# Altium schematic sheet PERIPHERALS.SchDoc
size A3; SheetNumber: 2; SheetTotal: 4
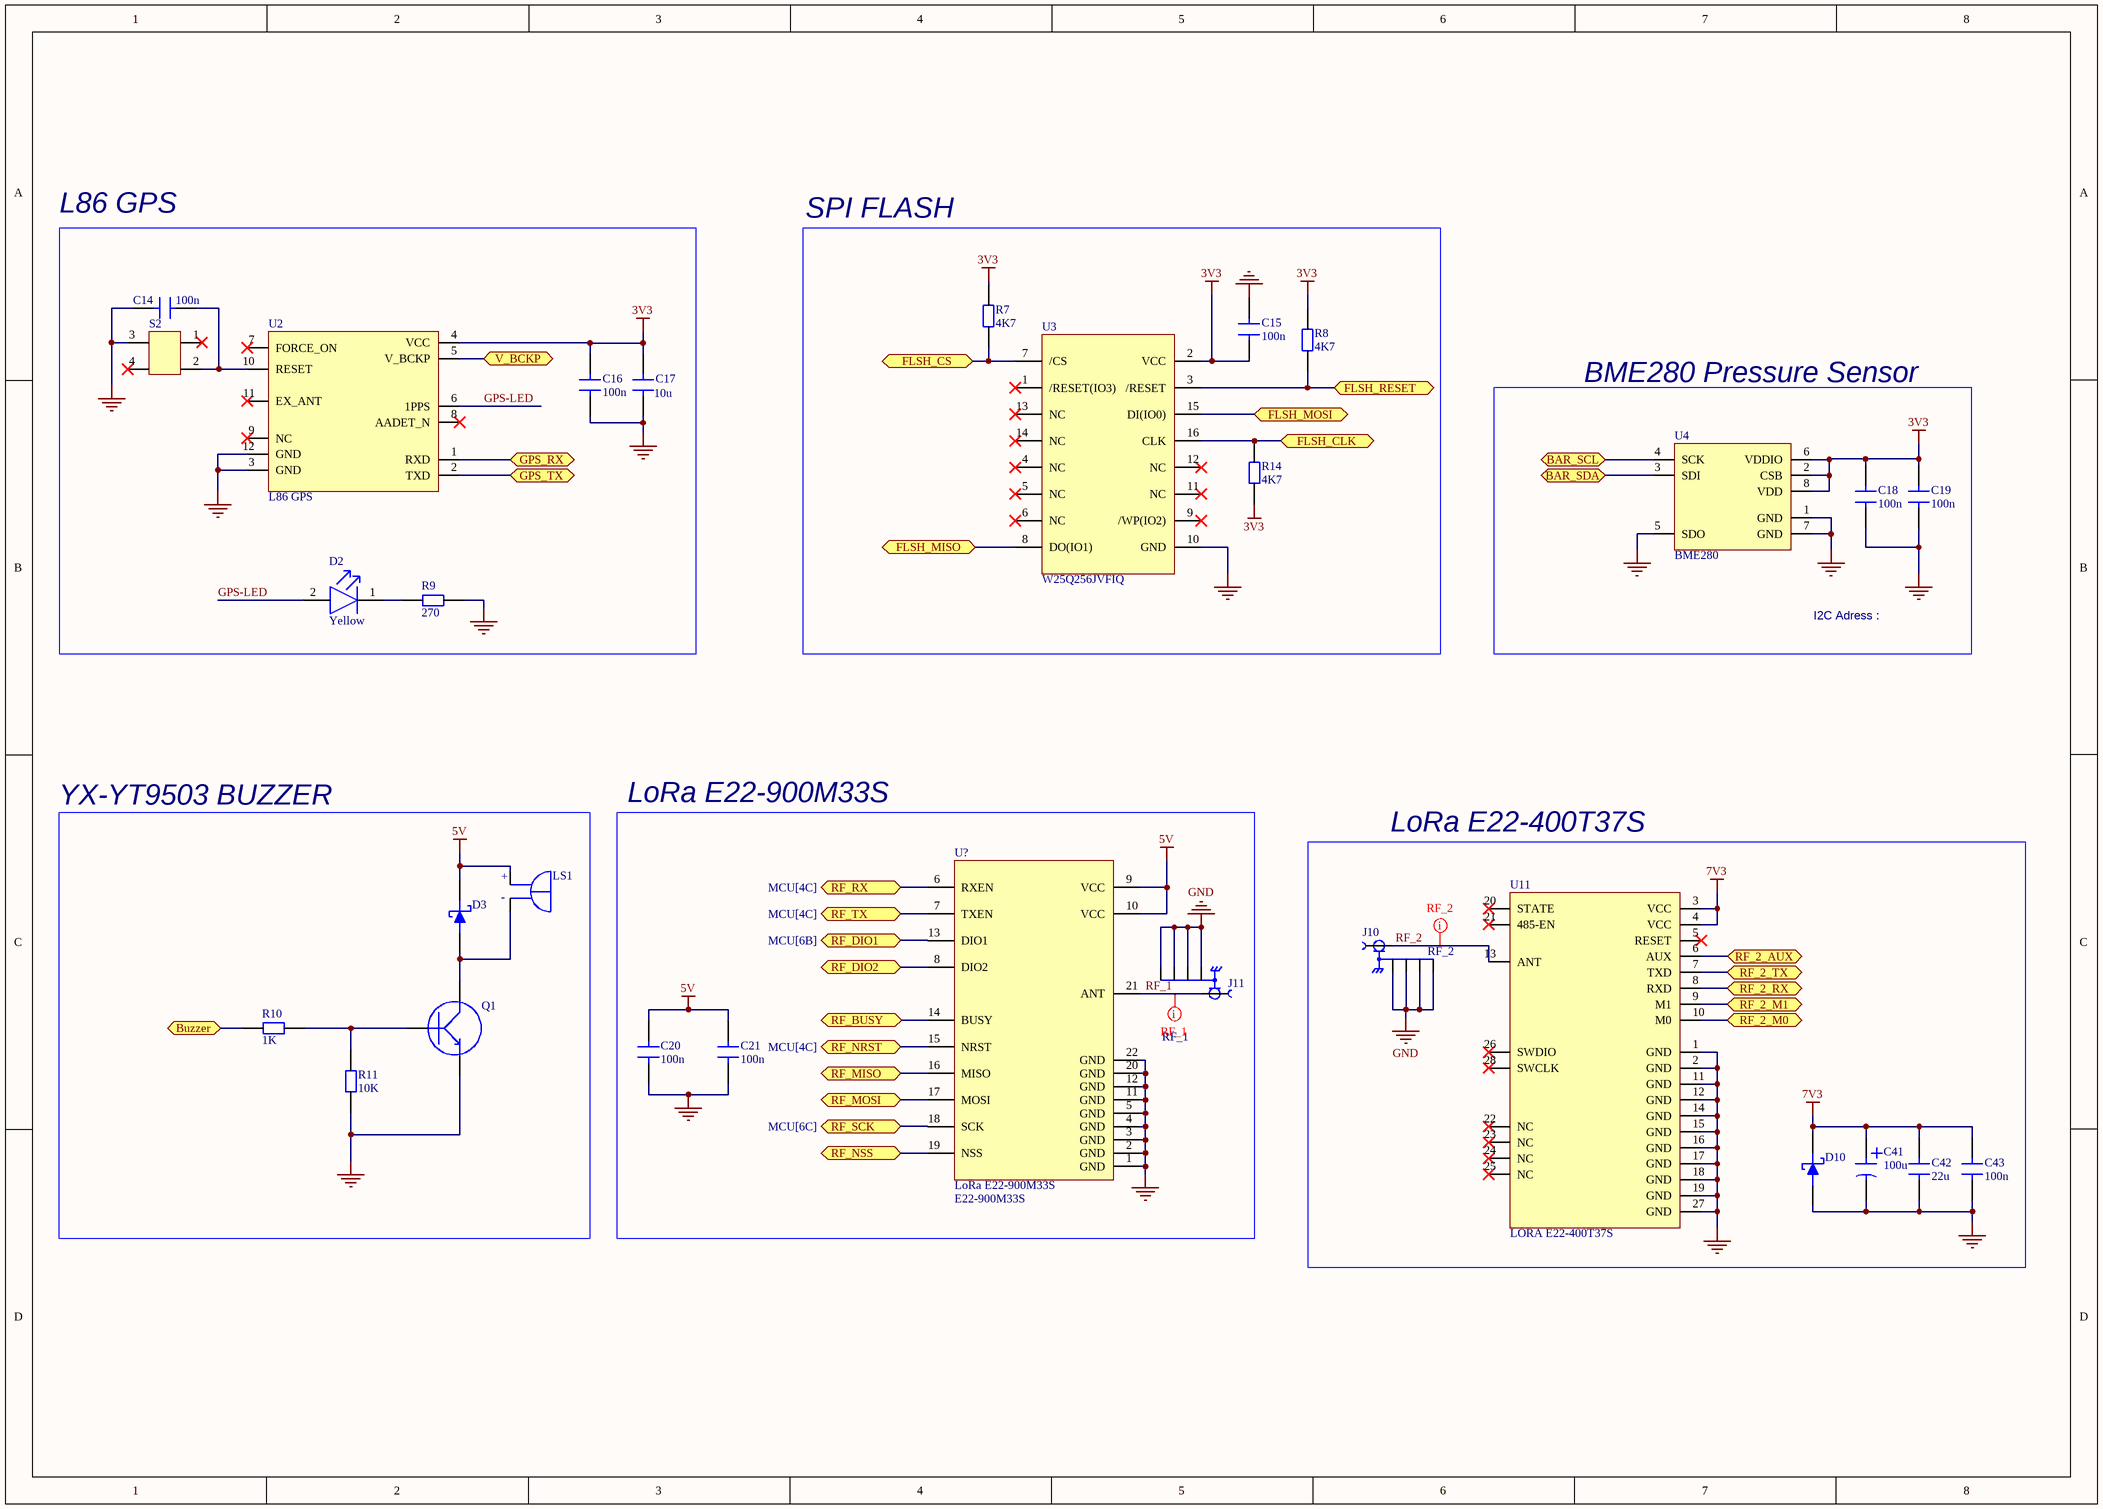
[diagram p0: PERIPHERALS.SchDoc]

## Parts
C14  100n  [CAP 0603]
C15  100n  [CAP 0603]
C16  100n  [CAP 0805]
C17  10u  [CAP 0805]
C18  100n  [CAP 0603]
C19  100n  [CAP 0603]
C20  100n  [CAP 0805]
C21  100n  [CAP 0805]
C41  100u  [865060653010]
C42  22u  [CAP 1210]
C43  100n  [CAP 0805]
D2  Yellow  [FP-LTST-C170YKT-MFG]
D3  TMBAT49FILM  [TMBAT49FILM]  (value not drawn)
D10  SMBJ14CA  [SMBJ12CA-13-F]  (value not drawn)
J10  RFPC-SMA27-F  [GRADCONN_RFPC-SMA27-F]  (value not drawn)
J11  RFPC-SMA27-F  [GRADCONN_RFPC-SMA27-F]  (value not drawn)
LS1  KXG0912C  [XDCR_KXG0912C]  (value not drawn)
Q1  BC817-25W,115  [BC817-25]  (value not drawn)
R7  4K7  [RES 0805]
R8  4K7  [RES 0805]
R9  270  [RES 0805]
R10  1K  [RES 0805]
R11  10K  [RES 0805]
R14  4K7  [RES 0805]
S2  FSM4JSMATR  [FSM4JSMATR]  (value not drawn)
U2  L86 GPS  [L86]
U3  W25Q256JVFIQ  [W25Q256JVFIQ]
U4  BME280  [BME280]
U11  LORA E22-400T37S  [LORA E22-400T37S]
U?  LoRa E22-900M33S  LoRa: E22-900M33S  [LoRa E22-900M33S]

## Blocks framed on the sheet
L86 GPS: C14 C16 C17 D2 R9 S2 U2
SPI FLASH: C15 R7 R8 R14 U3
BME280 Pressure Sensor: C18 C19 U4
YX-YT9503 BUZZER: D3 LS1 Q1 R10 R11
LoRa E22-900M33S: C20 C21 J11 U?
LoRa E22-400T37S: C41-C43 D10 J10 U11

## Ports
BAR_SCL (bidir, see CONNECTORS[7C], MCU[6C]), BAR_SDA (bidir, see CONNECTORS[7C], MCU[6C]), Buzzer (bidir, see MCU[6C]), FLSH_CLK (bidir, see MCU[6B]), FLSH_CS (bidir, see MCU[6B]), FLSH_MISO (bidir, see MCU[6B]), FLSH_MOSI (bidir, see MCU[6B]), FLSH_RESET (bidir, see MCU[4C]), GPS_RX (bidir, see MCU[6B]), GPS_TX (bidir, see MCU[6B]), RF_2_AUX (bidir, see MCU[6B]), RF_2_M0 (bidir, see MCU[6C]), RF_2_M1 (bidir, see MCU[6C]), RF_2_RX (bidir, see MCU[6B]), RF_2_TX (bidir, see MCU[6B]), RF_BUSY (bidir, see MCU[6B]), RF_DIO1 (bidir, see MCU[6B]), RF_DIO2 (bidir, see MCU[4C]), RF_MISO (bidir, see MCU[6C]), RF_MOSI (bidir, see MCU[6C]), RF_NRST (bidir, see MCU[4C]), RF_NSS (bidir, see MCU[6C]), RF_RX (bidir, see MCU[4C]), RF_SCK (bidir, see MCU[6C]), RF_TX (bidir, see MCU[4C]), V_BCKP (bidir, see MCU[5B], POWER[4D])

## Nets
3V3: C15.1 C16.2 C17.2 C18.2 C19.2 R7.2 R8.2 R14.1 U2.4(VCC) U3.2(VCC) U4.2(CSB) U4.6(VDDIO) U4.8(VDD)
5V: C20.2 C21.2 D3.1 LS1.P(POS) U?.9(VCC) U?.10(VCC)
7V3: C41.1(P) C42.2 C43.2 D10.2 U11.3(VCC) U11.4(VCC)
GND: C14.1 C15.2 C16.1 C17.1 C18.1 C19.1 C20.1 C21.1 C41.2(N) C42.1 C43.1 D10.1 J10.G1 J10.G2 J10.G3 J10.G4 J11.G1 J11.G2 J11.G3 J11.G4 Q1.2(E) R9.2 R11.1 S2.3 U2.3(GND) U2.12(GND) U3.10(GND) U4.1(GND) U4.5(SDO) U4.7(GND) U11.1(GND) U11.2(GND) U11.11(GND) U11.12(GND) U11.14(GND) U11.15(GND) U11.16(GND) U11.17(GND) U11.18(GND) U11.19(GND) U11.27(GND) U?.1(GND) U?.2(GND) U?.3(GND) U?.4(GND) U?.5(GND) U?.11(GND) U?.12(GND) U?.20(GND) U?.22(GND)
BAR_SCL: U4.4(SCK) ; port BAR_SCL
BAR_SDA: U4.3(SDI) ; port BAR_SDA
Buzzer: R10.1 ; port Buzzer
FLSH_CLK: R14.2 U3.16(CLK) ; port FLSH_CLK
FLSH_CS: R7.1 U3.7(/CS) ; port FLSH_CS
FLSH_MISO: U3.8(DO(IO1)) ; port FLSH_MISO
FLSH_MOSI: U3.15(DI(IO0)) ; port FLSH_MOSI
FLSH_RESET: R8.1 U3.3(/RESET) ; port FLSH_RESET
GPS-LED: D2.2(A) U2.6(1PPS)
GPS_RX: U2.1(RXD) ; port GPS_RX
GPS_TX: U2.2(TXD) ; port GPS_TX
RF_1: J11.1 U?.21(ANT)
RF_2: J10.1 U11.13(ANT)
RF_2_AUX: U11.6(AUX) ; port RF_2_AUX
RF_2_M0: U11.10(M0) ; port RF_2_M0
RF_2_M1: U11.9(M1) ; port RF_2_M1
RF_2_RX: U11.8(RXD) ; port RF_2_RX
RF_2_TX: U11.7(TXD) ; port RF_2_TX
RF_BUSY: U?.14(BUSY) ; port RF_BUSY
RF_DIO1: U?.13(DIO1) ; port RF_DIO1
RF_DIO2: U?.8(DIO2) ; port RF_DIO2
RF_MISO: U?.16(MISO) ; port RF_MISO
RF_MOSI: U?.17(MOSI) ; port RF_MOSI
RF_NRST: U?.15(NRST) ; port RF_NRST
RF_NSS: U?.19(NSS) ; port RF_NSS
RF_RX: U?.6(RXEN) ; port RF_RX
RF_SCK: U?.18(SCK) ; port RF_SCK
RF_TX: U?.7(TXEN) ; port RF_TX
V_BCKP: U2.5(V_BCKP) ; port V_BCKP
NetC14_2: C14.2 S2.2 U2.10(RESET)
NetD2_1: D2.1(C) R9.1
NetD3_2: D3.2 LS1.N(NEG) Q1.3(C)
NetQ1_1: Q1.1(B) R10.2 R11.2

Not connected (* = marked no-connect by the designer): S2 1* 4*; U2 7(FORCE_ON)* 8(AADET_N)* 9(NC)* 11(EX_ANT)*; U3 1(/RESET(IO3))* 4(NC)* 5(NC)* 6(NC)* 9(/WP(IO2))* 11(NC)* 12(NC)* 13(NC)* 14(NC)*; U11 5(RESET)* 20(STATE)* 21(485-EN)* 22(NC)* 23(NC)* 24(NC)* 25(NC)* 26(SWDIO)* 28(SWCLK)*

## Layout directives
net class RF_1: RF_1
net class RF_2: RF_2

## Notes on the sheet
- I2C Adress :
- (in symbol KXG0912C) +; -

## Library data of the parts
C14 C15 C18 C19 = CAP 0603 50V: Capacitor SMD 0603 50V
C16 C20 C21 C43 = CAP 0805 50V: Capacitor SMD 0805 50V
C17 = CAP 0805 25V: Capacitor SMD 0805 25V
C41 = 865060653010: Aluminum Electrolytic Capacitor, Polarized, Aluminum (wet), 50V, 20% +Tol, 20% -Tol, 100uF, Surface Mount, 3333; Manufacturer: Wurth Electronics; Supplier 1: Farnell; Manufacturer Part Number: 865060653010; RoHS: Yes; Category: Aluminum Electrolytic Capacitors; Stock 1: 176; Pricing 1: 1=0,825, 10=0,63, 50=0,551, 100=0,481, 200=0,427, 500=0,355, 2500=0,348, 5000=0,341 (EUR); ComponentLink1URL: http://www.farnell.com/datasheets/1880078.pdf?src-supplier=Farnell; ComponentLink1Description: http://www.farnell.com/datasheets/1880078.pdf?src-supplier=Farnell; ComponentLink2URL: http://www.farnell.com/datasheets/1880078.pdf?src-supplier=Newark; ComponentLink2Description: http://www.farnell.com/datasheets/1880078.pdf?src-supplier=Newark; ComponentLink3URL: http://www.farnell.com/datasheets/1880078.pdf?src-supplier=Element14; ComponentLink3Description: http://www.farnell.com/datasheets/1880078.pdf?src-supplier=Element14; ComponentLink4URL: https://katalog.we-online.de/pbs/datasheet/865060653010.pdf?src-supplier=Digikey; ComponentLink4Description: https://katalog.we-online.de/pbs/datasheet/865060653010.pdf?src-supplier=Digikey
C42 = CAP 1210 25V: Capacitor SMD 1210 25V
D2 = CMP-1674-00003-7: LED YELLOW CLEAR SMD; Viewing Angle: 130°; Luminous Intensity: 6mcd; Test Current: 10mA; Number of Elements: 1; Forward Current: 20mA; Forward Voltage: 2.1V; Reverse Voltage: 5V; Power Dissipation: 60mW; Lens Style: Diffused; Wavelength: 585nm; Lens Color: Colorless; Dominant Wavelength: 588nm; RoHS Compliant: Yes; Height: 1.1mm; Min Operating Temperature: -55°C; Max Operating Temperature: 85°C; Number of LEDs: 1; Mount: Surface Mount; Radiation Hardening: No; Illumination Color: Yellow; Length: 3.2mm; Series: CHIPLED 0805; Package Quantity: 1; Packaging: Tape and Reel; Color: Yellow; Depth: 1.6mm; Case/Package: 0805; Lens Transparency: Clear; Case Code (Imperial): 0805; Width: 1.25mm; Case Code (Metric): 2012; Lead Free: Lead Free; Power Rating: 60mW; Number of Pins: 2
D3 = TMBAT49FILM: Rectifier Diode Small Signal Schottky Si 80V 0.5A 2-Pin MELF T/R; Manufacturer: STMicroelectronics; Supplier 1: Mouser; Manufacturer Part Number: TMBAT49FILM; RoHS: Yes; Category: Rectifier Diodes; Stock 1: 11456; Pricing 1: 1=0,55, 10=0,468, 50=0,468, 100=0,326, 1000=0,228, 10000=0,159 (USD); ComponentLink1URL: https://datasheet.ciiva.com/4715/cd00000809-92451-4715102.pdf?src-supplier=Mouser; ComponentLink1Description: https://datasheet.ciiva.com/4715/cd00000809-92451-4715102.pdf?src-supplier=Mouser; ComponentLink2URL: https://datasheet.ciiva.com/16988/0900766b80db299a-16988744.pdf?src-supplier=Allied+Electronics; ComponentLink2Description: https://datasheet.ciiva.com/16988/0900766b80db299a-16988744.pdf?src-supplier=Allied+Electronics; ComponentLink3URL: https://datasheet.ciiva.com/22697/1766334-22697011.pdf?src-supplier=Element14; ComponentLink3Description: https://datasheet.ciiva.com/22697/1766334-22697011.pdf?src-supplier=Element14; ComponentLink4URL: https://datasheet.ciiva.com/16501/cd00000809-16501349.pdf?src-supplier=Future+Electronics; ComponentLink4Description: https://datasheet.ciiva.com/16501/cd00000809-16501349.pdf?src-supplier=Future+Electronics; ComponentLink5URL: https://datasheet.ciiva.com/15144/getdatasheetpartid-39750-15144086.pdf?src-supplier=Verical; ComponentLink5Description: https://datasheet.ciiva.com/15144/getdatasheetpartid-39750-15144086.pdf?src-supplier=Verical; ComponentLink6URL: https://datasheet.ciiva.com/915/cd00000809-915819.pdf?src-supplier=Digikey; ComponentLink6Description: https://datasheet.ciiva.com/915/cd00000809-915819.pdf?src-supplier=Digikey; ComponentLink7URL: https://datasheet.ciiva.com/915/cd00000809-915820.pdf?src-supplier=Digikey; ComponentLink7Description: https://datasheet.ciiva.com/915/cd00000809-915820.pdf?src-supplier=Digikey; ComponentLink8URL: https://datasheet.ciiva.com/915/cd00000809-915821.pdf?src-supplier=Digikey; ComponentLink8Description: https://datasheet.ciiva.com/915/cd00000809-915821.pdf?src-supplier=Digikey; ComponentLink9URL: https://datasheet.ciiva.com/7622/1766334-7622348.pdf?src-supplier=Element14; ComponentLink9Description: https://datasheet.ciiva.com/7622/1766334-7622348.pdf?src-supplier=Element14; ComponentLink10URL: https://datasheet.ciiva.com/7964/cd00000809-7964118.pdf?src-supplier=Element14; ComponentLink10Description: https://datasheet.ciiva.com/7964/cd00000809-7964118.pdf?src-supplier=Element14
D10 = SMBJ14CA: TVS DIODE 14VWM 23.2VC DO214AA; Manufacturer: Littelfuse; Operating Supply Voltage: 14V; Max Surge Current: 25.9A; Number of Channels: 1; Polarity: Bidirectional; Breakdown Voltage: 15.6V; Clamping Voltage: 23.2V; Peak Pulse Power: 600W; Power Line Protection: No; Test Current: 1mA; Leakage Current: 1uA; Diode Type: ZENER; Max Breakdown Voltage: 17.2V; Supplier 1: Future Electronics; Manufacturer Part Number: SMBJ14CA; RoHS: Yes; Category: TVS Diodes; Stock 1: 1300; Pricing 1: 1=0,36, 15=0,29, 75=0,245, 300=0,205, 1500=0,163 (USD); Mount: Surface Mount; Case/Package: DO-214AA; Number of Pins: 2; Weight: 0.00328oz; Min Operating Temperature: -65°C; Max Operating Temperature: 150°C; Packaging: Tape and Reel; Package Quantity: 3000; Reverse Breakdown Voltage: 15.6V; Number of Bidirectional Channels: 1; Reverse Standoff Voltage: 14V; Min Breakdown Voltage: 15.6V; Number of Elements: 1; Peak Pulse Current: 25.9A; Voltage Rating (DC): 14V; Series: SMBJ; Direction: Bidirectional; Termination: SMD/SMT; Max Power Dissipation: 600W; Power Dissipation: 600W; Current: 1mA; Voltage: 14V; Clamping Voltage-Max: 23.2V; Length: 5.59mm; Width: 3.94mm; Height: 2.44mm; RoHS Compliant: Yes; Lead Free: Lead Free; Reach SVHC Compliant: No; ComponentLink1URL: https://datasheet.ciiva.com/331/littelfuse-tvs-diode-smbj-datasheet-pdf-331530.pdf?src-supplier=Digikey; ComponentLink1Description: https://datasheet.ciiva.com/331/littelfuse-tvs-diode-smbj-datasheet-pdf-331530.pdf?src-supplier=Digikey; ComponentLink2URL: https://datasheet.ciiva.com/331/littelfuse-tvs-diode-smbj-datasheet-pdf-331531.pdf?src-supplier=Digikey; ComponentLink2Description: https://datasheet.ciiva.com/331/littelfuse-tvs-diode-smbj-datasheet-pdf-331531.pdf?src-supplier=Digikey; ComponentLink3URL: https://datasheet.ciiva.com/331/littelfuse-tvs-diode-smbj-datasheet-pdf-331529.pdf?src-supplier=Digikey; ComponentLink3Description: https://datasheet.ciiva.com/331/littelfuse-tvs-diode-smbj-datasheet-pdf-331529.pdf?src-supplier=Digikey
J10 J11 = RFPC-SMA27-F: MF: {'manufacturer': u'GradConn'}; Package: None; Price: None; Value: *; MP: RFPC-SMA27-F; Availability: Unavailable
LS1 = KXG0912C: Magnetic Indicator(Active Buzzer), 85Hz, 2.73 dB (SPL), 9.6 diameter(Ø)/L, Width, 5 Height, Pine Type; MP: KXG0912C; Package: None; Price: None; Availability: Unavailable; Value: *
Q1 = BC817-25W,115: BC817 Series 45 V 500 mA NPN General Purpose Transistor - SOT-23; Manufacturer: Nexperia; Supplier 1: Future Electronics; Manufacturer Part Number: BC817-25W,115; RoHS: Yes; Category: BJTs; Stock 1: 99000; Pricing 1: 3000=0,0169, 12000=0,0162, 45000=0,0155, 90000=0,0152, 225000=0,0144 (USD); ComponentLink1URL: https://datasheet.octopart.com/BC817-25W%2C115-NXP-datasheet-29749.pdf?src-supplier=Future+Electronics; ComponentLink1Description: https://datasheet.octopart.com/BC817-25W%2C115-NXP-datasheet-29749.pdf?src-supplier=Future+Electronics; ComponentLink2URL: http://www.farnell.com/datasheets/699988.pdf?src-supplier=Newark; ComponentLink2Description: http://www.farnell.com/datasheets/699988.pdf?src-supplier=Newark; ComponentLink3URL: https://datasheet.octopart.com/BC817-25W%2C115-Nexperia-datasheet-155782301.pdf?src-supplier=TME; ComponentLink3Description: https://datasheet.octopart.com/BC817-25W%2C115-Nexperia-datasheet-155782301.pdf?src-supplier=TME; Supplier Part Number 1: 5067352
R7-R11 R14 = RES 0805: Resistor SMD 0805
S2 = FSM4JSMATR: Switch Tactile OFF (ON) SPST Round Button Gull Wing 0.05A 24VDC 1.57N SMD T/R; Manufacturer: TE Connectivity Alcoswitch; Supplier 1: Digi-Key; Manufacturer Part Number: FSM4JSMATR; RoHS: Yes; Category: Pushbutton Switches; Stock 1: 84996; Pricing 1: 1=0,36, 10=0,351, 25=0,33, 100=0,2866, 250=0,26, 500=0,24188 (USD); ComponentLink1URL: https://datasheet.ciiva.com/16320/eng-cs-1308111-1-switches-core-program-catalog-0308-16320065.pdf?src-supplier=Future+Electronics; ComponentLink1Description: https://datasheet.ciiva.com/16320/eng-cs-1308111-1-switches-core-program-catalog-0308-16320065.pdf?src-supplier=Future+Electronics; ComponentLink2URL: https://datasheet.ciiva.com/1530/1683375-1530944.pdf?src-supplier=Element14; ComponentLink2Description: https://datasheet.ciiva.com/1530/1683375-1530944.pdf?src-supplier=Element14; ComponentLink3URL: https://datasheet.ciiva.com/23765/1486934-23765878.pdf?src-supplier=Newark; ComponentLink3Description: https://datasheet.ciiva.com/23765/1486934-23765878.pdf?src-supplier=Newark; ComponentLink4URL: https://datasheet.ciiva.com/7638/921681-7638037.pdf?src-supplier=Element14; ComponentLink4Description: https://datasheet.ciiva.com/7638/921681-7638037.pdf?src-supplier=Element14
U3 = W25Q256JVFIQ: IC FLASH 256MBIT SPI/QUAD 16SOIC .....                                      The W25Q256JV (256M-bit) Serial Flash memory provides a storage solution for systems with limited / space, pins and power. The 25Q series offers flexibility and performance well beyond ordinary Serial Flash / devices. They are ideal for code shadowing to RAM, executing code directly from Dual/Quad SPI (XIP) / and storing voice, text and data. The device operates on a single 2.7V to 3.6V power supply with current / consumption as low as 1µA for power-down
U4 = BME280: SENSOR PRESSURE HUMIDITY TEMP; Manufacturer: Bosch; Sensor Type: Temperature; Output Type: SPI,I2C; Accuracy: 3%; Response Time: 1s; Supplier 1: Future Electronics; Manufacturer Part Number: BME280; RoHS: No; Category: Temperature and Humidity Sensors; Stock 1: 5185; Pricing 1: 1=6,1, 20=5,53, 150=5,14, 1000=4,78, 5000=4,48 (USD); Mount: Surface Mount; Case/Package: LGA; Number of Pins: 8; Min Operating Temperature: -40°C; Max Operating Temperature: 85°C; Packaging: Cut Tape; Lead Free: Lead Free; ComponentLink1URL: https://ae-bst.resource.bosch.com/media/_tech/media/datasheets/BST-BME280-DS002.pdf?src-supplier=Digi-Key; ComponentLink1Description: https://ae-bst.resource.bosch.com/media/_tech/media/datasheets/BST-BME280-DS002.pdf?src-supplier=Digi-Key; ComponentLink2URL: https://ae-bst.resource.bosch.com/media/_tech/media/product_flyer/BME280_Productflyer_BST_20170109.pdf?src-supplier=Mouser; ComponentLink2Description: https://ae-bst.resource.bosch.com/media/_tech/media/product_flyer/BME280_Productflyer_BST_20170109.pdf?src-supplier=Mouser; ComponentLink3URL: https://ae-bst.resource.bosch.com/media/_tech/media/product_flyer/BME280_Productflyer_BST_20170109.pdf?src-supplier=Arrow+Electronics; ComponentLink3Description: https://ae-bst.resource.bosch.com/media/_tech/media/product_flyer/BME280_Productflyer_BST_20170109.pdf?src-supplier=Arrow+Electronics; ComponentLink4URL: https://ae-bst.resource.bosch.com/media/_tech/media/product_flyer/BME280_Productflyer_BST_20170109.pdf?src-supplier=NAC+Semi; ComponentLink4Description: https://ae-bst.resource.bosch.com/media/_tech/media/product_flyer/BME280_Productflyer_BST_20170109.pdf?src-supplier=NAC+Semi
U11 = LORA E22-400T37S: E22-400T37S LoRa Module
U? = LoRa E22-900M33S: SX1262 LoRa spread spectrum wireless module 868MHz/915MHz, SPI, 16km, 24*38.5mm.